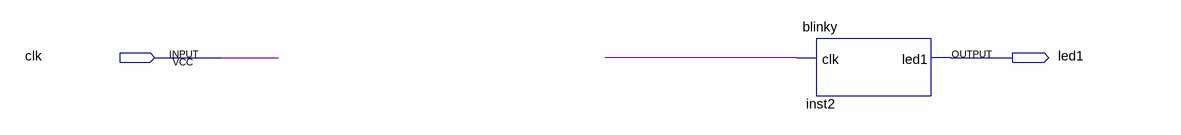
[diagram p0: schematic sheet]
// Quartus schematic Block1.bdf as structural Verilog: 1 symbols, 2 pins
module Block1 (
  input  clk,
  output led1
);

  wire undriven;

  blinky inst2 (.clk(undriven), .led1(led1));
endmodule
